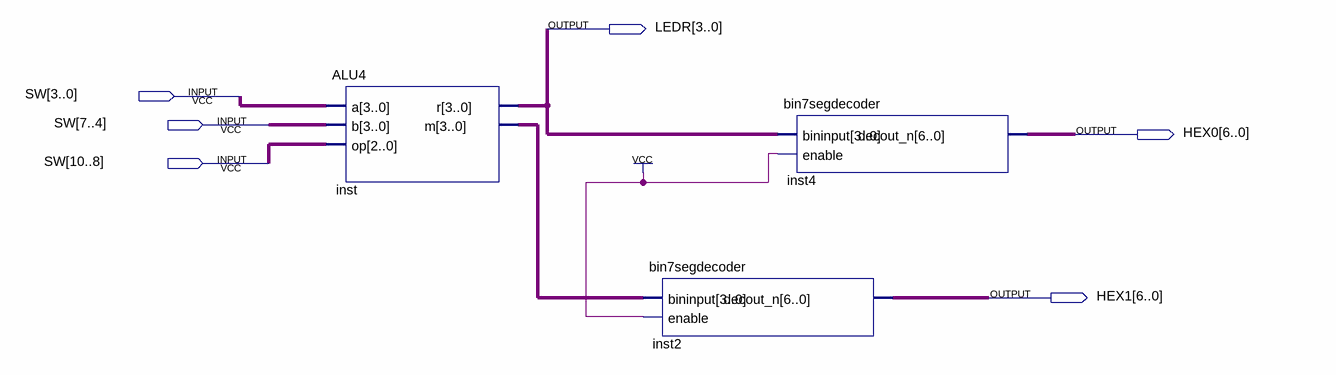
[diagram p0: schematic sheet]
// Quartus schematic ALUDemo.bdf as structural Verilog: 3 symbols, 6 pins
module ALUDemo (
  input  [10:0] SW,
  output [3:0] LEDR,
  output [6:0] HEX0,
  output [6:0] HEX1
);

  wire [3:0] inst_m;

  ALU4 inst (.a(SW[3:0]), .b(SW[7:4]), .op(SW[10:8]), .r(LEDR), .m(inst_m));
  bin7segdecoder inst2 (.bininput(inst_m), .enable(1'b1), .decout_n(HEX1));
  bin7segdecoder inst4 (.bininput(LEDR), .enable(1'b1), .decout_n(HEX0));
endmodule
